# Altium schematic sheet Sheet0 - Cover Sheet.SchDoc: CyDAQ
size A; Revision: 0; SheetNumber: 0
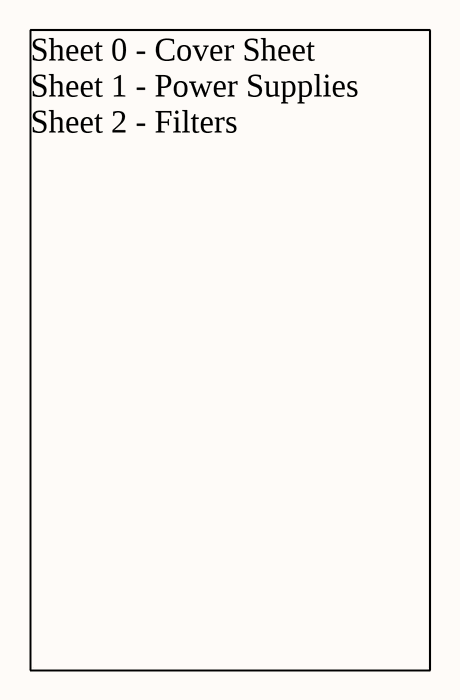
[diagram p0: Sheet0 - Cover Sheet.SchDoc]

## Notes on the sheet
- Sheet 0 - Cover Sheet
  Sheet 1 - Power Supplies
  Sheet 2 - Filters